# Altium project PM12_CFD.PrjPcb (part 2 of 2)

## Sheet ADCMP.SchDoc
size A4; SheetNumber: 4; SheetTotal: 5
Used 12 times, as channels CFD1, CFD2, CFD3, CFD4, CFD5, CFD6, CFD7, CFD8, CFD9, CFD10, CFD11, CFD12. Parts and nets are listed once, with the designators drawn on the sheet.
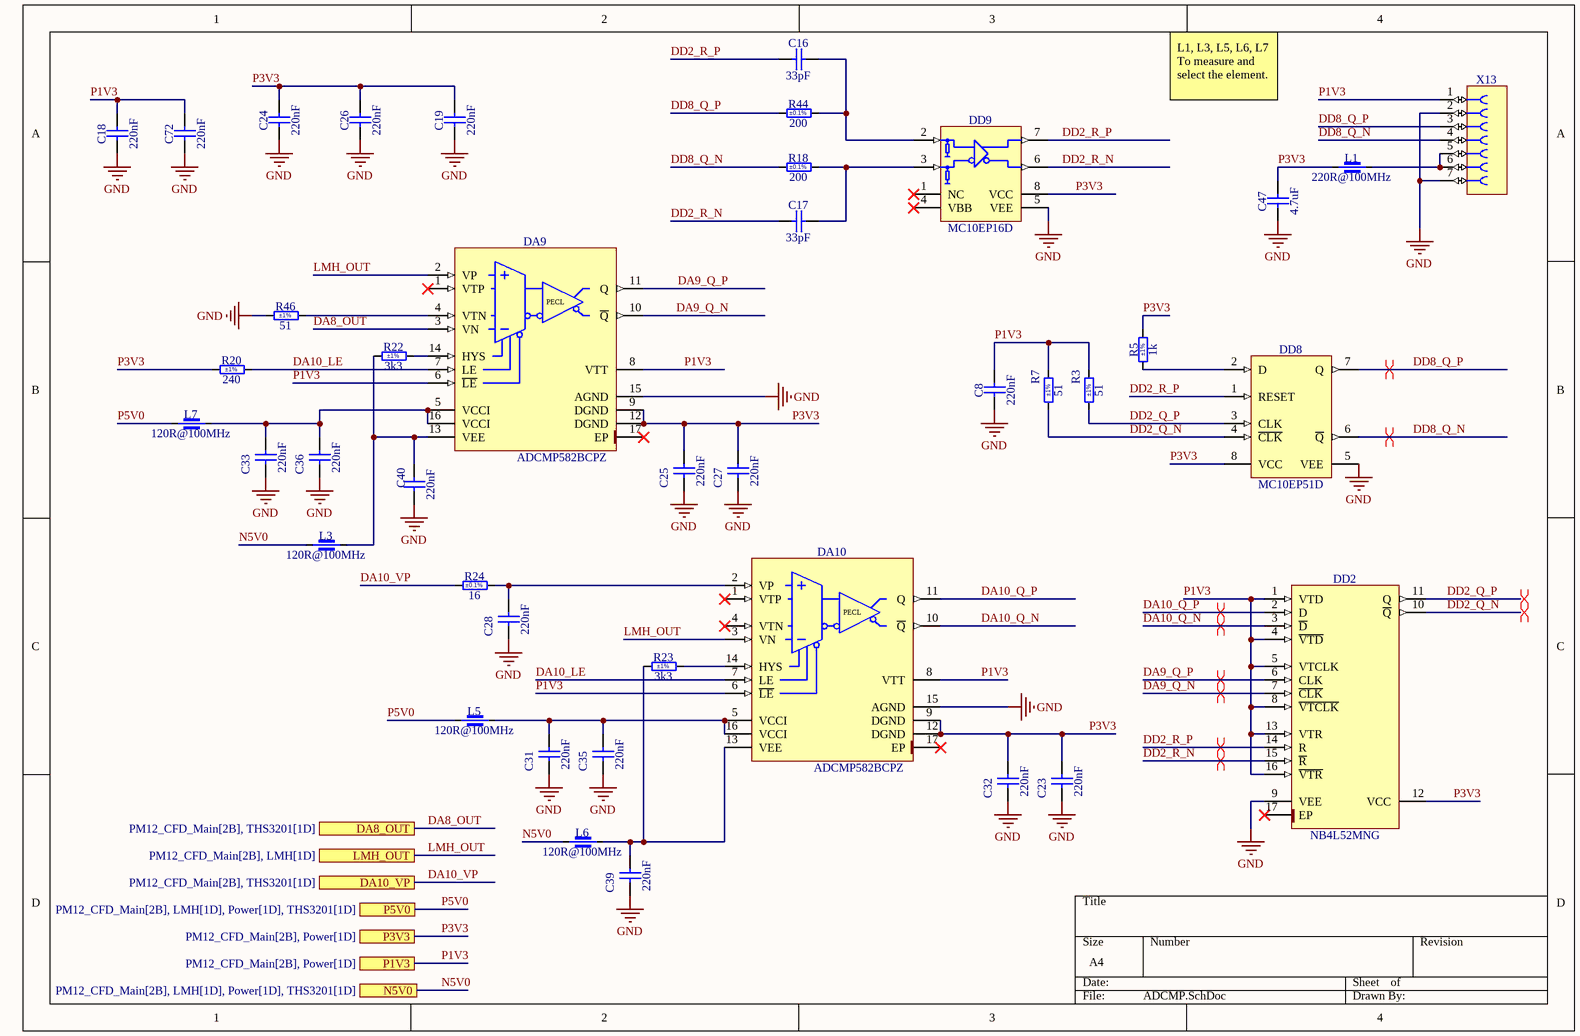
[diagram p4: ADCMP.SchDoc]

### Parts
C8  220nF  [CAPC2012X135N]
C16  33pF  [CAPC2012X135N]
C17  33pF  [CAPC2012X135N]
C18  220nF  [CAPC1608X87N]
C19  220nF  [CAPC2012X135N]
C23  220nF  [CAPC1608X87N]
C24  220nF  [CAPC2012X135N]
C25  220nF  [CAPC1608X87N]
C26  220nF  [CAPC2012X135N]
C27  220nF  [CAPC1608X87N]
C28  220nF  [CAPC1608X87N]
C31  220nF  [CAPC1608X87N]
C32  220nF  [CAPC1608X87N]
C33  220nF  [CAPC1608X87N]
C35  220nF  [CAPC1608X87N]
C36  220nF  [CAPC1608X87N]
C39  220nF  [CAPC1608X87N]
C40  220nF  [CAPC1608X87N]
C47  4.7uF  [CAPC3216X180N]
C72  220nF  [CAPC2012X135N]
DA9  ADCMP582BCPZ  [QFN50P300X300X80-17N-S145]
DA10  ADCMP582BCPZ  [QFN50P300X300X80-17N-S145]
DD2  NB4L52MNG  [QFN50P300X300X100-17N-S185]
DD8  MC10EP51D  [SOIC127P600X175-8N]
DD9  MC10EP16D  [SOIC127P600X175-8N]
L1  220R@100MHz  [INDC2012X105N]
L3  120R@100MHz  [INDC1608X95N]
L5  120R@100MHz  [INDC1608X95N]
L6  120R@100MHz  [INDC1608X95N]
L7  120R@100MHz  [INDC1608X95N]
R3  51  Tolerance: ±1%  [RESC2012X60N]
R5  1k  Tolerance: ±1%  [RESC2012X60N]
R7  51  Tolerance: ±1%  [RESC2012X60N]
R18  200  Tolerance: ±0.1%  [RESC2012X60N]
R20  240  Tolerance: ±1%  [RESC1608X55N]
R22  3k3  Tolerance: ±1%  [RESC1608X55N]
R23  3k3  Tolerance: ±1%  [RESC1608X55N]
R24  16  Tolerance: ±0.1%  [RESC1608X64N]
R44  200  Tolerance: ±0.1%  [RESC2012X60N]
R46  51  Tolerance: ±1%  [RESC1608X55N]
X13  Socket 7  [SAMTEC_CES-107-01-T-S]  (value not drawn)

### Ports
DA8_OUT (see PM12_CFD_Main[2B], THS3201[1D]), DA10_VP (see PM12_CFD_Main[2B], THS3201[1D]), LMH_OUT (see PM12_CFD_Main[2B], LMH[1D]), N5V0 (see PM12_CFD_Main[2B], LMH[1D], Power[1D], THS3201[1D]), P1V3 (see PM12_CFD_Main[2B], Power[1D]), P3V3 (see PM12_CFD_Main[2B], Power[1D]), P5V0 (see PM12_CFD_Main[2B], LMH[1D], Power[1D], THS3201[1D])

### Nets
GND: C8.1 C18.1 C19.1 C23.1 C24.1 C25.1 C26.1 C27.1 C28.1 C31.1 C32.1 C33.1 C35.1 C36.1 C39.1 C40.1 C47.1 C72.1 DA9.15(AGND) DA10.15(AGND) DD2.9(VEE) DD8.5(VEE) DD9.5(VEE) R46.1 X13.2 X13.7
DA8_OUT: DA9.3(VN) ; port DA8_OUT
DA9_Q_N: DA9.10(~{Q}) DD2.7(~{CLK})
DA9_Q_P: DA9.11(Q) DD2.6(CLK)
DA10_LE: DA9.7(LE) DA10.7(LE) R20.2
DA10_Q_N: DA10.10(~{Q}) DD2.3(~{D})
DA10_Q_P: DA10.11(Q) DD2.2(D)
DA10_VP: R24.1 ; port DA10_VP
DD2_Q_N: DD2.10(~{Q}) DD8.4(~{CLK}) R7.1
DD2_Q_P: DD2.11(Q) DD8.3(CLK) R3.1
DD2_R_N: C17.1 DD2.15(~{R}) DD9.6(~{Q})
DD2_R_P: C16.1 DD2.14(R) DD8.1(RESET) DD9.7(Q)
DD8_Q_N: DD8.6(~{Q}) R18.1 X13.4
DD8_Q_P: DD8.7(Q) R44.1 X13.3
LMH_OUT: DA9.2(VP) DA10.3(VN) ; port LMH_OUT
N5V0: L3.1 L6.1 ; port N5V0
P1V3: C8.2 C18.2 C72.2 DA9.6(~{LE}) DA9.8(VTT) DA10.6(~{LE}) DA10.8(VTT) DD2.1(VTD) DD2.4(~{VTD}) DD2.5(VTCLK) DD2.8(~{VTCLK}) DD2.13(VTR) DD2.16(~{VTR}) R3.2 R7.2 X13.1 ; port P1V3
P3V3: C19.2 C23.2 C24.2 C25.2 C26.2 C27.2 C32.2 C47.2 DA9.9(DGND) DA9.12(DGND) DA10.9(DGND) DA10.12(DGND) DD2.12(VCC) DD8.8(VCC) DD9.8(VCC) L1.1 R5.2 R20.1 ; port P3V3
P5V0: L5.1 L7.1 ; port P5V0
NetC16_2: C16.2 DD9.2(D0) R44.2
NetC17_2: C17.2 DD9.3(~{D0}) R18.2
NetC28_2: C28.2 DA10.2(VP) R24.2
NetC31_2: C31.2 C35.2 DA10.5(VCCI) DA10.16(VCCI) L5.2
NetC33_2: C33.2 C36.2 DA9.5(VCCI) DA9.16(VCCI) L7.2
NetC39_2: C39.2 DA10.13(VEE) L6.2 R23.1
NetC40_2: C40.2 DA9.13(VEE) L3.2 R22.1
NetDA9_4: DA9.4(VTN) R46.2
NetDA9_14: DA9.14(HYS) R22.2
NetDA10_14: DA10.14(HYS) R23.2
NetDD8_2: DD8.2(D) R5.1
NetL1_2: L1.2 X13.5 X13.6

Not connected (* = marked no-connect by the designer): DA9 1(VTP)* 17(EP)*; DA10 1(VTP)* 4(VTN)* 17(EP)*; DD2 17(EP)*; DD9 1(NC)* 4(VBB)*

### Channels
CFD1: designators end in _CFD1; ports DA8_OUT=DA8_OUT DA10_VP=DA10_VP LMH_OUT=LMH_OUT N5V0=N5V0 P1V3=P1V3 P3V3=P3V3 P5V0=P5V0
CFD2: designators end in _CFD2; ports DA8_OUT=DA8_OUT DA10_VP=DA10_VP LMH_OUT=LMH_OUT N5V0=N5V0 P1V3=P1V3 P3V3=P3V3 P5V0=P5V0
CFD3: designators end in _CFD3; ports DA8_OUT=DA8_OUT DA10_VP=DA10_VP LMH_OUT=LMH_OUT N5V0=N5V0 P1V3=P1V3 P3V3=P3V3 P5V0=P5V0
CFD4: designators end in _CFD4; ports DA8_OUT=DA8_OUT DA10_VP=DA10_VP LMH_OUT=LMH_OUT N5V0=N5V0 P1V3=P1V3 P3V3=P3V3 P5V0=P5V0
CFD5: designators end in _CFD5; ports DA8_OUT=DA8_OUT DA10_VP=DA10_VP LMH_OUT=LMH_OUT N5V0=N5V0 P1V3=P1V3 P3V3=P3V3 P5V0=P5V0
CFD6: designators end in _CFD6; ports DA8_OUT=DA8_OUT DA10_VP=DA10_VP LMH_OUT=LMH_OUT N5V0=N5V0 P1V3=P1V3 P3V3=P3V3 P5V0=P5V0
CFD7: designators end in _CFD7; ports DA8_OUT=DA8_OUT DA10_VP=DA10_VP LMH_OUT=LMH_OUT N5V0=N5V0 P1V3=P1V3 P3V3=P3V3 P5V0=P5V0
CFD8: designators end in _CFD8; ports DA8_OUT=DA8_OUT DA10_VP=DA10_VP LMH_OUT=LMH_OUT N5V0=N5V0 P1V3=P1V3 P3V3=P3V3 P5V0=P5V0
CFD9: designators end in _CFD9; ports DA8_OUT=DA8_OUT DA10_VP=DA10_VP LMH_OUT=LMH_OUT N5V0=N5V0 P1V3=P1V3 P3V3=P3V3 P5V0=P5V0
CFD10: designators end in _CFD10; ports DA8_OUT=DA8_OUT DA10_VP=DA10_VP LMH_OUT=LMH_OUT N5V0=N5V0 P1V3=P1V3 P3V3=P3V3 P5V0=P5V0
CFD11: designators end in _CFD11; ports DA8_OUT=DA8_OUT DA10_VP=DA10_VP LMH_OUT=LMH_OUT N5V0=N5V0 P1V3=P1V3 P3V3=P3V3 P5V0=P5V0
CFD12: designators end in _CFD12; ports DA8_OUT=DA8_OUT DA10_VP=DA10_VP LMH_OUT=LMH_OUT N5V0=N5V0 P1V3=P1V3 P3V3=P3V3 P5V0=P5V0

### Layout directives
differential pair: DA9_Q_N_CFD1, DA9_Q_P_CFD1, DA10_Q_N_CFD1, DA10_Q_P_CFD1, DD2_Q_N_CFD1, DD2_Q_P_CFD1, DD2_R_N_CFD1, DD2_R_P_CFD1, DD8_Q_N_CFD1, DD8_Q_P_CFD1

### Notes on the sheet
- L1, L3, L5, L6, L7 To measure and select the element.
- (in symbol ADCMP582BCPZ) PECL

### Library data of the parts
C8 C19 C24 C26 C72 = CC0805_220NF_50V_10%_X7R: Non-polarised capacitor; Part Description: SMD Multilayer Chip Ceramic Capacitor; Manufacturer: GENERIC; Manufacturer1 Part Number: GRM21BR71H224KA01L; Voltage: 50V; TC: X7R; Tolerance: ±10%; Part Number: CC0805_220NF_50V_10%_X7R; Component Kind: Standard; Component Type: Standard; Pin Count: 2; Value: 220nF; Status: Preferred; Manufacturer Part Number: CC0805_220NF_50V_10%_X7R; Case: 0805; Mounted: Yes; Socket: No; SMD: Yes; Sense: No; Manufacturer1 Example: MURATA; Manufacturer1 ComponentHeight: 1.35mm; HelpURL: \\cern.ch\dfs\Applications\Altium\Datasheets\CC0805_X7R_MURATA.pdf; Author: CERN DEM JLC; CreateDate: 03.12.2007; LatestRevisionDate: 03.12.2007
C16 C17 = CC0805_33PF_50V_5%_NP0: Non-polarised capacitor; Part Description: SMD Multilayer Chip Ceramic Capacitor; Manufacturer: GENERIC; Manufacturer1 Part Number: 223886115339; Voltage: 50V; TC: C0G/NP0; Tolerance: ±5%; Part Number: CC0805_33PF_50V_5%_NP0; Component Kind: Standard; Component Type: Standard; Pin Count: 2; Value: 33pF; Status: Preferred; Manufacturer Part Number: CC0805_33PF_50V_5%_NP0; Case: 0805; Mounted: Yes; Socket: No; SMD: Yes; Sense: No; Manufacturer1 Example: PHYCOMP; Manufacturer1 ComponentHeight: 1.35mm; HelpURL: \\cern.ch\dfs\Applications\Altium\Datasheets\CC0805_NP0_PHYCOMP.pdf; Author: CERN DEM JLC; CreateDate: 03.12.2007; LatestRevisionDate: 03.12.2007
C18 C23 C25 C27 C28 C31-C33 C35 C36 C39 C40 = CC0603_220NF_25V_10%_X7R: Non-polarised capacitor; Part Description: SMD Multilayer Chip Ceramic Capacitor; Manufacturer: GENERIC; Manufacturer1 Part Number: C0603C224K3RACTU; Voltage: 25V; TC: X7R; Tolerance: ±10%; Part Number: CC0603_220NF_25V_10%_X7R; Component Kind: Standard; Component Type: Standard; Pin Count: 2; Value: 220nF; Status: Preferred; Manufacturer Part Number: CC0603_220NF_25V_10%_X7R; Case: 0603; Mounted: Yes; Socket: No; SMD: Yes; Sense: No; Manufacturer1 Example: KEMET; Manufacturer1 ComponentHeight: 0.87mm; HelpURL: \\cern.ch\dfs\Applications\Altium\Datasheets\CC0603_X7R_KEMET.pdf; Author: CERN DEM JLC; CreateDate: 29.10.2014; LatestRevisionDate: 29.10.2014
C47 = CC1206_4.7UF_25V_10%_X7R: Non-polarised capacitor; Part Description: SMD Multilayer Chip Ceramic Capacitor; Manufacturer: GENERIC; Manufacturer1 Part Number: C1206C475K3RAC; Voltage: 25V; TC: X7R; Tolerance: ±10%; Part Number: CC1206_4.7UF_25V_10%_X7R; Component Kind: Standard; Component Type: Standard; Pin Count: 2; Value: 4.7uF; Status: Preferred; Manufacturer Part Number: CC1206_4.7UF_25V_10%_X7R; Case: 1206; Mounted: Yes; Socket: No; SMD: Yes; Sense: No; Manufacturer1 Example: KEMET; Manufacturer1 ComponentHeight: 1.8mm; HelpURL: \\cern.ch\dfs\Applications\Altium\Datasheets\CC1206_X7R_KEMET.pdf; Author: CERN DEM WB; CreateDate: 25.07.2018; LatestRevisionDate: 25.07.2018
DA9 DA10 = ADCMP582BCPZ: Ultrafast SiGe Voltage Comparator; Manufacturer: ANALOG DEVICES; PressFit: No; Bonding: No; Part Number: ADCMP582BCPZ; Component Kind: Standard; Component Type: Standard; Device: ADCMP582BCPZ; PackageDescription: QFN, 0.50mm Pitch, Square; 16 Pin, 3.00mm L X 3.00mm W X 0.80mm H body (w/Thermal Tab 1.45 X 1.45mm), IPC Medium Density; Part Description: Ultrafast SiGe Voltage Comparator; Manufacturer Part Number: ADCMP582BCP; Pin Count: 17; Case: QFN16; Mounted: Yes; Socket: No; SMD: Yes; Sense: No; ComponentHeight: 0.8mm; Author: CERN DEM MR; HelpURL: \\cern.ch\dfs\Applications\Altium\Datasheets\ADCMP582BCPZ.pdf; CreateDate: 23.01.2018; LatestRevisionDate: 31.03.2022
DD2 = NB4L52MNG: 2.5 V/3.3 V/5.0 V Differential Data/Clock D Flip-Flop with Reset; Manufacturer: ON SEMICONDUCTOR; PressFit: No; Bonding: No; Part Number: NB4L52MNG; Component Kind: Standard; Component Type: Standard; Device: NB4L52MNG; PackageDescription: QFN, 0.50mm Pitch, Square; 16 Pin, 3.00mm L X 3.00mm W X 1.00mm H body (w/Thermal Tab 1.85 X 1.85mm), IPC Medium Density; Part Description: 2.5 V/3.3 V/5.0 V Differential Data/Clock D Flip-Flop with Reset; Manufacturer Part Number: NB4L52MN; Pin Count: 16; Case: QFN16; Mounted: Yes; Socket: No; SMD: Yes; Sense: No; ComponentHeight: 1mm; Author: CERN DEM MR; HelpURL: \\cern.ch\dfs\Applications\Altium\Datasheets\NB4L52MNG.pdf; CreateDate: 15.01.2016; LatestRevisionDate: 04.04.2022
DD8 = MC10EP51D: 3.3V/5V ECL D Flip-Flop with Reset and Differential Clock; Manufacturer: ON SEMICONDUCTOR; PressFit: No; Bonding: No; Part Number: MC10EP51D; Component Kind: Standard; Component Type: Standard; Device: MC10EP51D; PackageDescription: SOIC 8, Pitch 1.27mm - Body 4x5mm, IPC Medium Density; Part Description: 3.3V/5V ECL D Flip-Flop with Reset and Differential Clock; Manufacturer Part Number: MC10EP51D; Pin Count: 8; Case: SOIC8; Mounted: Yes; Socket: No; SMD: Yes; Sense: No; ComponentHeight: 1.75mm; Author: CERN DEM HF; HelpURL: \\cern.ch\dfs\Applications\Altium\Datasheets\MC10EP51.pdf; CreateDate: 25.04.2024; LatestRevisionDate: 25.04.2024
DD9 = MC10EP16D: 3.3V / 5V ECL Differential Receiver/Driver; Manufacturer: ON SEMICONDUCTOR; PressFit: No; Bonding: No; Part Number: MC10EP16D; Component Kind: Standard; Component Type: Standard; Device: MC10EP16D; PackageDescription: SOIC 8, Pitch 1.27mm - Body 4x5mm, IPC Medium Density; Part Description: 3.3V/5V ECL Differential Receiver/Driver; Manufacturer Part Number: MC10EP16D; Pin Count: 8; Case: SOIC8; Mounted: Yes; Socket: No; SMD: Yes; Sense: No; ComponentHeight: 1.75mm; Author: CERN DEM HF; HelpURL: \\cern.ch\dfs\Applications\Altium\Datasheets\MC10EP16.pdf; CreateDate: 25.04.2024; LatestRevisionDate: 25.04.2024
L1 = IND0805_TDK_MPZ2012S221A: Part Description: SMT Chip Bead for General Power Line (MPZ Series); Manufacturer: TDK; Power: 3A; Resistance: 0.04R; Tolerance: ±25%; Part Number: IND0805_TDK_MPZ2012S221A; Component Kind: Standard; Component Type: Standard; Pin Count: 2; Value: 220R@100MHz; Manufacturer Part Number: MPZ2012S221A; Case: 0805; Mounted: Yes; Socket: No; SMD: Yes; Sense: No; ComponentHeight: 1.05mm; HelpURL: \\cern.ch\dfs\Applications\Altium\Datasheets\IND0805_TDK_MPZ2012.pdf; Author: CERN DEM HF; CreateDate: 04.10.2021; LatestRevisionDate: 04.10.2021
L3 L5-L7 = IND0603_MURATA_BLM18PG121SN1D: Part Description: SMD EMIFIL Chip Ferrite Bead; Manufacturer: MURATA; Power: 2A; Resistance: 0.05R; Part Number: IND0603_MURATA_BLM18PG121SN1D; Component Kind: Standard; Component Type: Standard; Pin Count: 2; Value: 120R@100MHz; Manufacturer Part Number: BLM18PG121SN1D; Case: 0603; Mounted: Yes; Socket: No; SMD: Yes; Sense: No; ComponentHeight: 0.95mm; HelpURL: \\cern.ch\dfs\Applications\Altium\Datasheets\IND0603_MURATA_BLM18P.pdf; Author: CERN DEM BC; CreateDate: 27.07.2015; LatestRevisionDate: 25.10.2018
R3 R7 = R0805_51R_1%_0.125W_100PPM: Resistor - 1%; Part Description: General Purpose Thick Film Chip Resistor; Manufacturer: GENERIC; Manufacturer1 Part Number: NRC10F51R0TRF; Power: 0.125W; TC: ±100ppm/°C; PressFit: No; Part Number: R0805_51R_1%_0.125W_100PPM; Component Kind: Standard; Component Type: Standard; Pin Count: 2; Value: 51; Status: Preferred; Manufacturer Part Number: R0805_51R_1%_0.125W_100PPM; Case: 0805; Mounted: Yes; Sense: No; Socket: No; SMD: Yes; Manufacturer1 Example: NIC COMPONENT; Manufacturer1 ComponentHeight: 0.6mm; HelpURL: \\cern.ch\dfs\Applications\Altium\Datasheets\R0805_NIC_NRC.pdf; Author: CERN DEM JLC; CreateDate: 03.12.2007; LatestRevisionDate: 13.03.2008
R5 = R0805_1K_1%_0.125W_100PPM: Resistor - 1%; Part Description: General Purpose Thick Film Chip Resistor; Manufacturer: GENERIC; Manufacturer1 Part Number: NRC10F1001TRF; Power: 0.125W; TC: ±100ppm/°C; PressFit: No; Part Number: R0805_1K_1%_0.125W_100PPM; Component Kind: Standard; Component Type: Standard; Pin Count: 2; Value: 1k; Status: Preferred; Manufacturer Part Number: R0805_1K_1%_0.125W_100PPM; Case: 0805; Mounted: Yes; Sense: No; Socket: No; SMD: Yes; Manufacturer1 Example: NIC COMPONENT; Manufacturer1 ComponentHeight: 0.6mm; HelpURL: \\cern.ch\dfs\Applications\Altium\Datasheets\R0805_NIC_NRC.pdf; Author: CERN DEM JLC; CreateDate: 03.12.2007; LatestRevisionDate: 13.03.2008
R18 R44 = R0805_200R_0.1%_0.1W_10PPM: Resistor - 0.1%; Part Description: Thin Film Chip Resistor; Manufacturer: GENERIC; Manufacturer1 Part Number: RN73C2A200RBTG; Power: 0.1W; TC: ±10ppm; PressFit: No; Part Number: R0805_200R_0.1%_0.1W_10PPM; Component Kind: Standard; Component Type: Standard; Pin Count: 2; Value: 200; Status: Not Recommended; Manufacturer Part Number: R0805_200R_0.1%_0.1W_10PPM; Case: 0805; Mounted: Yes; Sense: No; Socket: No; SMD: Yes; Manufacturer1 Example: TYCO HOLSWORTHY; Manufacturer1 ComponentHeight: 0.6mm; HelpURL: \\cern.ch\dfs\Applications\Altium\Datasheets\R0805_Tyco_RN73.pdf; Author: CERN DEM JLC; CreateDate: 03.12.2007; LatestRevisionDate: 13.03.2008
R20 = R0603_240R_1%_0.1W_100PPM: Resistor - 1%; Part Description: General Purpose Thick Film Chip Resistor; Manufacturer: GENERIC; Manufacturer1 Part Number: NRC06F2400TRF; Power: 0.1W; TC: ±100ppm/°C; PressFit: No; Part Number: R0603_240R_1%_0.1W_100PPM; Component Kind: Standard; Component Type: Standard; Pin Count: 2; Value: 240; Status: Preferred; Manufacturer Part Number: R0603_240R_1%_0.1W_100PPM; Case: 0603; Mounted: Yes; Sense: No; Socket: No; SMD: Yes; Manufacturer1 Example: NIC COMPONENT; Manufacturer1 ComponentHeight: 0.55mm; HelpURL: \\cern.ch\dfs\Applications\Altium\Datasheets\R0603_NIC_NRC.pdf; Author: CERN DEM JLC; CreateDate: 03.12.2007; LatestRevisionDate: 13.03.2008
R22 R23 = R0603_3K3_1%_0.1W_100PPM: Resistor - 1%; Part Description: General Purpose Thick Film Chip Resistor; Manufacturer: GENERIC; Manufacturer1 Part Number: NRC06F3301TRF; Power: 0.1W; TC: ±100ppm/°C; PressFit: No; Part Number: R0603_3K3_1%_0.1W_100PPM; Component Kind: Standard; Component Type: Standard; Pin Count: 2; Value: 3k3; Status: Preferred; Manufacturer Part Number: R0603_3K3_1%_0.1W_100PPM; Case: 0603; Mounted: Yes; Sense: No; Socket: No; SMD: Yes; Manufacturer1 Example: NIC COMPONENT; Manufacturer1 ComponentHeight: 0.55mm; HelpURL: \\cern.ch\dfs\Applications\Altium\Datasheets\R0603_NIC_NRC.pdf; Author: CERN DEM JLC; CreateDate: 03.12.2007; LatestRevisionDate: 13.03.2008
R24 = R0603_16R_0.1%_0.1W_10PPM: Resistor - 0.1%; Part Description: Thin Film Chip Resistor; Manufacturer: GENERIC; Manufacturer1 Part Number: RT0603BRB0716RL; Power: 0.1W; TC: ±10ppm/°C; PressFit: No; Part Number: R0603_16R_0.1%_0.1W_10PPM; Component Kind: Standard; Component Type: Standard; Pin Count: 2; Value: 16; Status: Not Recommended; Manufacturer Part Number: R0603_16R_0.1%_0.1W_10PPM; Case: 0603; Mounted: Yes; Sense: No; Socket: No; SMD: Yes; Manufacturer1 Example: YAGEO; Manufacturer1 ComponentHeight: 0.55mm; HelpURL: \\cern.ch\dfs\Applications\Altium\Datasheets\R0603_YAGEO_RT.pdf; Author: CERN DEM HF; CreateDate: 25.04.2024; LatestRevisionDate: 25.04.2024
R46 = R0603_51R_1%_0.1W_100PPM: Resistor - 1%; Part Description: General Purpose Thick Film Chip Resistor; Manufacturer: GENERIC; Manufacturer1 Part Number: NRC06F51R0TRF; Power: 0.1W; TC: ±100ppm/°C; PressFit: No; Part Number: R0603_51R_1%_0.1W_100PPM; Component Kind: Standard; Component Type: Standard; Pin Count: 2; Value: 51; Status: Preferred; Manufacturer Part Number: R0603_51R_1%_0.1W_100PPM; Case: 0603; Mounted: Yes; Sense: No; Socket: No; SMD: Yes; Manufacturer1 Example: NIC COMPONENT; Manufacturer1 ComponentHeight: 0.55mm; HelpURL: \\cern.ch\dfs\Applications\Altium\Datasheets\R0603_NIC_NRC.pdf; Author: CERN DEM JLC; CreateDate: 03.12.2007; LatestRevisionDate: 13.03.2008
X13 = SAMTEC_CES-107-01-L-S: Connector 7 Female; Part Description: 7 Contacts, Pitch 2.54mm, Single Row Through Mount Straight Socket (Lead Length 3.25mm); Manufacturer: SAMTEC; PressFit: No; Author: CERN DEM HF; Part Number: SAMTEC_CES-107-01-L-S; Component Kind: Standard; Component Type: Standard; Pin Count: 7; Family: Socket 7; Mounted: Yes; Socket: No; SMD: No; Sense: No; Status: None; Manufacturer Part Number: CES-107-01-L-S; ComponentHeight: 5.08mm; HelpURL: \\cern.ch\dfs\Applications\Altium\Datasheets\SAMTEC_CES-107-01-T-S.pdf; CreateDate: 25.04.2024; LatestRevisionDate: 25.04.2024

## Nets that join several sheets
GND: PM12_CFD_Main (8 pins), CFD1 (21 pins), CFD2 (21 pins), CFD3 (21 pins), CFD4 (21 pins), CFD5 (21 pins), CFD6 (21 pins), CFD7 (21 pins), CFD8 (21 pins), CFD9 (21 pins), CFD10 (21 pins), CFD11 (21 pins), CFD12 (21 pins), CFD1 (8 pins), CFD2 (8 pins), CFD3 (8 pins), CFD4 (8 pins), CFD5 (8 pins), CFD6 (8 pins), CFD7 (8 pins), CFD8 (8 pins), CFD9 (8 pins), CFD10 (8 pins), CFD11 (8 pins), CFD12 (8 pins), CFD1 (13 pins), CFD2 (13 pins), CFD3 (13 pins), CFD4 (13 pins), CFD5 (13 pins), CFD6 (13 pins), CFD7 (13 pins), CFD8 (13 pins), CFD9 (13 pins), CFD10 (13 pins), CFD11 (13 pins), CFD12 (13 pins), CFD1 (26 pins), CFD2 (26 pins), CFD3 (26 pins), CFD4 (26 pins), CFD5 (26 pins), CFD6 (26 pins), CFD7 (26 pins), CFD8 (26 pins), CFD9 (26 pins), CFD10 (26 pins), CFD11 (26 pins), CFD12 (26 pins)
N5V5: PM12_CFD_Main (C21.2 C45.2 C46.2 L4.2), CFD1 (L9_CFD1.1), CFD2 (L9_CFD2.1), CFD3 (L9_CFD3.1), CFD4 (L9_CFD4.1), CFD5 (L9_CFD5.1), CFD6 (L9_CFD6.1), CFD7 (L9_CFD7.1), CFD8 (L9_CFD8.1), CFD9 (L9_CFD9.1), CFD10 (L9_CFD10.1), CFD11 (L9_CFD11.1), CFD12 (L9_CFD12.1)
P5V5: PM12_CFD_Main (C20.1 C34.1 C44.1 L2.2), CFD1 (L8_CFD1.1), CFD2 (L8_CFD2.1), CFD3 (L8_CFD3.1), CFD4 (L8_CFD4.1), CFD5 (L8_CFD5.1), CFD6 (L8_CFD6.1), CFD7 (L8_CFD7.1), CFD8 (L8_CFD8.1), CFD9 (L8_CFD9.1), CFD10 (L8_CFD10.1), CFD11 (L8_CFD11.1), CFD12 (L8_CFD12.1)
DA2_P: CFD1 (R2_CFD1.1 X12_CFD1.1), CFD1 (R50_CFD1.1)
DA2_P: CFD2 (R2_CFD2.1 X12_CFD2.1), CFD2 (R50_CFD2.1)
DA2_P: CFD3 (R2_CFD3.1 X12_CFD3.1), CFD3 (R50_CFD3.1)
DA2_P: CFD4 (R2_CFD4.1 X12_CFD4.1), CFD4 (R50_CFD4.1)
DA2_P: CFD5 (R2_CFD5.1 X12_CFD5.1), CFD5 (R50_CFD5.1)
DA2_P: CFD6 (R2_CFD6.1 X12_CFD6.1), CFD6 (R50_CFD6.1)
DA2_P: CFD7 (R2_CFD7.1 X12_CFD7.1), CFD7 (R50_CFD7.1)
DA2_P: CFD8 (R2_CFD8.1 X12_CFD8.1), CFD8 (R50_CFD8.1)
DA2_P: CFD9 (R2_CFD9.1 X12_CFD9.1), CFD9 (R50_CFD9.1)
DA2_P: CFD10 (R2_CFD10.1 X12_CFD10.1), CFD10 (R50_CFD10.1)
DA2_P: CFD11 (R2_CFD11.1 X12_CFD11.1), CFD11 (R50_CFD11.1)
DA2_P: CFD12 (R2_CFD12.1 X12_CFD12.1), CFD12 (R50_CFD12.1)
DA6_P: CFD1 (C12_CFD1.2 DA6_CFD1.3 DA20_CFD1.3), CFD1 (X5_CFD1.2)
DA6_P: CFD2 (C12_CFD2.2 DA6_CFD2.3 DA20_CFD2.3), CFD2 (X5_CFD2.2)
DA6_P: CFD3 (C12_CFD3.2 DA6_CFD3.3 DA20_CFD3.3), CFD3 (X5_CFD3.2)
DA6_P: CFD4 (C12_CFD4.2 DA6_CFD4.3 DA20_CFD4.3), CFD4 (X5_CFD4.2)
DA6_P: CFD5 (C12_CFD5.2 DA6_CFD5.3 DA20_CFD5.3), CFD5 (X5_CFD5.2)
DA6_P: CFD6 (C12_CFD6.2 DA6_CFD6.3 DA20_CFD6.3), CFD6 (X5_CFD6.2)
DA6_P: CFD7 (C12_CFD7.2 DA6_CFD7.3 DA20_CFD7.3), CFD7 (X5_CFD7.2)
DA6_P: CFD8 (C12_CFD8.2 DA6_CFD8.3 DA20_CFD8.3), CFD8 (X5_CFD8.2)
DA6_P: CFD9 (C12_CFD9.2 DA6_CFD9.3 DA20_CFD9.3), CFD9 (X5_CFD9.2)
DA6_P: CFD10 (C12_CFD10.2 DA6_CFD10.3 DA20_CFD10.3), CFD10 (X5_CFD10.2)
DA6_P: CFD11 (C12_CFD11.2 DA6_CFD11.3 DA20_CFD11.3), CFD11 (X5_CFD11.2)
DA6_P: CFD12 (C12_CFD12.2 DA6_CFD12.3 DA20_CFD12.3), CFD12 (X5_CFD12.2)
DA8_OUT: CFD1 (DA8_CFD1.6 R19_CFD1.2), CFD1 (DA9_CFD1.3)
DA8_OUT: CFD2 (DA8_CFD2.6 R19_CFD2.2), CFD2 (DA9_CFD2.3)
DA8_OUT: CFD3 (DA8_CFD3.6 R19_CFD3.2), CFD3 (DA9_CFD3.3)
DA8_OUT: CFD4 (DA8_CFD4.6 R19_CFD4.2), CFD4 (DA9_CFD4.3)
DA8_OUT: CFD5 (DA8_CFD5.6 R19_CFD5.2), CFD5 (DA9_CFD5.3)
DA8_OUT: CFD6 (DA8_CFD6.6 R19_CFD6.2), CFD6 (DA9_CFD6.3)
DA8_OUT: CFD7 (DA8_CFD7.6 R19_CFD7.2), CFD7 (DA9_CFD7.3)
DA8_OUT: CFD8 (DA8_CFD8.6 R19_CFD8.2), CFD8 (DA9_CFD8.3)
DA8_OUT: CFD9 (DA8_CFD9.6 R19_CFD9.2), CFD9 (DA9_CFD9.3)
DA8_OUT: CFD10 (DA8_CFD10.6 R19_CFD10.2), CFD10 (DA9_CFD10.3)
DA8_OUT: CFD11 (DA8_CFD11.6 R19_CFD11.2), CFD11 (DA9_CFD11.3)
DA8_OUT: CFD12 (DA8_CFD12.6 R19_CFD12.2), CFD12 (DA9_CFD12.3)
DA10_VP: CFD1 (X5_CFD1.4), CFD1 (R24_CFD1.1)
DA10_VP: CFD2 (X5_CFD2.4), CFD2 (R24_CFD2.1)
DA10_VP: CFD3 (X5_CFD3.4), CFD3 (R24_CFD3.1)
DA10_VP: CFD4 (X5_CFD4.4), CFD4 (R24_CFD4.1)
DA10_VP: CFD5 (X5_CFD5.4), CFD5 (R24_CFD5.1)
DA10_VP: CFD6 (X5_CFD6.4), CFD6 (R24_CFD6.1)
DA10_VP: CFD7 (X5_CFD7.4), CFD7 (R24_CFD7.1)
DA10_VP: CFD8 (X5_CFD8.4), CFD8 (R24_CFD8.1)
DA10_VP: CFD9 (X5_CFD9.4), CFD9 (R24_CFD9.1)
DA10_VP: CFD10 (X5_CFD10.4), CFD10 (R24_CFD10.1)
DA10_VP: CFD11 (X5_CFD11.4), CFD11 (R24_CFD11.1)
DA10_VP: CFD12 (X5_CFD12.4), CFD12 (R24_CFD12.1)
LMH_OUT: CFD1 (DA7_CFD1.7 R39_CFD1.1 X4_CFD1.1), CFD1 (DA9_CFD1.2 DA10_CFD1.3)
LMH_OUT: CFD2 (DA7_CFD2.7 R39_CFD2.1 X4_CFD2.1), CFD2 (DA9_CFD2.2 DA10_CFD2.3)
LMH_OUT: CFD3 (DA7_CFD3.7 R39_CFD3.1 X4_CFD3.1), CFD3 (DA9_CFD3.2 DA10_CFD3.3)
LMH_OUT: CFD4 (DA7_CFD4.7 R39_CFD4.1 X4_CFD4.1), CFD4 (DA9_CFD4.2 DA10_CFD4.3)
LMH_OUT: CFD5 (DA7_CFD5.7 R39_CFD5.1 X4_CFD5.1), CFD5 (DA9_CFD5.2 DA10_CFD5.3)
LMH_OUT: CFD6 (DA7_CFD6.7 R39_CFD6.1 X4_CFD6.1), CFD6 (DA9_CFD6.2 DA10_CFD6.3)
LMH_OUT: CFD7 (DA7_CFD7.7 R39_CFD7.1 X4_CFD7.1), CFD7 (DA9_CFD7.2 DA10_CFD7.3)
LMH_OUT: CFD8 (DA7_CFD8.7 R39_CFD8.1 X4_CFD8.1), CFD8 (DA9_CFD8.2 DA10_CFD8.3)
LMH_OUT: CFD9 (DA7_CFD9.7 R39_CFD9.1 X4_CFD9.1), CFD9 (DA9_CFD9.2 DA10_CFD9.3)
LMH_OUT: CFD10 (DA7_CFD10.7 R39_CFD10.1 X4_CFD10.1), CFD10 (DA9_CFD10.2 DA10_CFD10.3)
LMH_OUT: CFD11 (DA7_CFD11.7 R39_CFD11.1 X4_CFD11.1), CFD11 (DA9_CFD11.2 DA10_CFD11.3)
LMH_OUT: CFD12 (DA7_CFD12.7 R39_CFD12.1 X4_CFD12.1), CFD12 (DA9_CFD12.2 DA10_CFD12.3)
N3V0: CFD1 (C9_CFD1.2 DA1_CFD1.5), CFD1 (C11_CFD1.2 DA7_CFD1.5 DA7_CFD1.9)
N3V0: CFD2 (C9_CFD2.2 DA1_CFD2.5), CFD2 (C11_CFD2.2 DA7_CFD2.5 DA7_CFD2.9)
N3V0: CFD3 (C9_CFD3.2 DA1_CFD3.5), CFD3 (C11_CFD3.2 DA7_CFD3.5 DA7_CFD3.9)
N3V0: CFD4 (C9_CFD4.2 DA1_CFD4.5), CFD4 (C11_CFD4.2 DA7_CFD4.5 DA7_CFD4.9)
N3V0: CFD5 (C9_CFD5.2 DA1_CFD5.5), CFD5 (C11_CFD5.2 DA7_CFD5.5 DA7_CFD5.9)
N3V0: CFD6 (C9_CFD6.2 DA1_CFD6.5), CFD6 (C11_CFD6.2 DA7_CFD6.5 DA7_CFD6.9)
N3V0: CFD7 (C9_CFD7.2 DA1_CFD7.5), CFD7 (C11_CFD7.2 DA7_CFD7.5 DA7_CFD7.9)
N3V0: CFD8 (C9_CFD8.2 DA1_CFD8.5), CFD8 (C11_CFD8.2 DA7_CFD8.5 DA7_CFD8.9)
N3V0: CFD9 (C9_CFD9.2 DA1_CFD9.5), CFD9 (C11_CFD9.2 DA7_CFD9.5 DA7_CFD9.9)
N3V0: CFD10 (C9_CFD10.2 DA1_CFD10.5), CFD10 (C11_CFD10.2 DA7_CFD10.5 DA7_CFD10.9)
N3V0: CFD11 (C9_CFD11.2 DA1_CFD11.5), CFD11 (C11_CFD11.2 DA7_CFD11.5 DA7_CFD11.9)
N3V0: CFD12 (C9_CFD12.2 DA1_CFD12.5), CFD12 (C11_CFD12.2 DA7_CFD12.5 DA7_CFD12.9)
N5V0: CFD1 (C146_CFD1.2 DA12_CFD1.1 R1_CFD1.1), CFD1 (DA6_CFD1.4 DA20_CFD1.4), CFD1 (7 pins), CFD1 (L3_CFD1.1 L6_CFD1.1)
N5V0: CFD2 (C146_CFD2.2 DA12_CFD2.1 R1_CFD2.1), CFD2 (DA6_CFD2.4 DA20_CFD2.4), CFD2 (7 pins), CFD2 (L3_CFD2.1 L6_CFD2.1)
N5V0: CFD3 (C146_CFD3.2 DA12_CFD3.1 R1_CFD3.1), CFD3 (DA6_CFD3.4 DA20_CFD3.4), CFD3 (7 pins), CFD3 (L3_CFD3.1 L6_CFD3.1)
N5V0: CFD4 (C146_CFD4.2 DA12_CFD4.1 R1_CFD4.1), CFD4 (DA6_CFD4.4 DA20_CFD4.4), CFD4 (7 pins), CFD4 (L3_CFD4.1 L6_CFD4.1)
N5V0: CFD5 (C146_CFD5.2 DA12_CFD5.1 R1_CFD5.1), CFD5 (DA6_CFD5.4 DA20_CFD5.4), CFD5 (7 pins), CFD5 (L3_CFD5.1 L6_CFD5.1)
N5V0: CFD6 (C146_CFD6.2 DA12_CFD6.1 R1_CFD6.1), CFD6 (DA6_CFD6.4 DA20_CFD6.4), CFD6 (7 pins), CFD6 (L3_CFD6.1 L6_CFD6.1)
N5V0: CFD7 (C146_CFD7.2 DA12_CFD7.1 R1_CFD7.1), CFD7 (DA6_CFD7.4 DA20_CFD7.4), CFD7 (7 pins), CFD7 (L3_CFD7.1 L6_CFD7.1)
N5V0: CFD8 (C146_CFD8.2 DA12_CFD8.1 R1_CFD8.1), CFD8 (DA6_CFD8.4 DA20_CFD8.4), CFD8 (7 pins), CFD8 (L3_CFD8.1 L6_CFD8.1)
N5V0: CFD9 (C146_CFD9.2 DA12_CFD9.1 R1_CFD9.1), CFD9 (DA6_CFD9.4 DA20_CFD9.4), CFD9 (7 pins), CFD9 (L3_CFD9.1 L6_CFD9.1)
N5V0: CFD10 (C146_CFD10.2 DA12_CFD10.1 R1_CFD10.1), CFD10 (DA6_CFD10.4 DA20_CFD10.4), CFD10 (7 pins), CFD10 (L3_CFD10.1 L6_CFD10.1)
N5V0: CFD11 (C146_CFD11.2 DA12_CFD11.1 R1_CFD11.1), CFD11 (DA6_CFD11.4 DA20_CFD11.4), CFD11 (7 pins), CFD11 (L3_CFD11.1 L6_CFD11.1)
N5V0: CFD12 (C146_CFD12.2 DA12_CFD12.1 R1_CFD12.1), CFD12 (DA6_CFD12.4 DA20_CFD12.4), CFD12 (7 pins), CFD12 (L3_CFD12.1 L6_CFD12.1)
P1V3: CFD1 (C42_CFD1.1 DA13_CFD1.5 R28_CFD1.2), CFD1 (16 pins)
P1V3: CFD2 (C42_CFD2.1 DA13_CFD2.5 R28_CFD2.2), CFD2 (16 pins)
P1V3: CFD3 (C42_CFD3.1 DA13_CFD3.5 R28_CFD3.2), CFD3 (16 pins)
P1V3: CFD4 (C42_CFD4.1 DA13_CFD4.5 R28_CFD4.2), CFD4 (16 pins)
P1V3: CFD5 (C42_CFD5.1 DA13_CFD5.5 R28_CFD5.2), CFD5 (16 pins)
P1V3: CFD6 (C42_CFD6.1 DA13_CFD6.5 R28_CFD6.2), CFD6 (16 pins)
P1V3: CFD7 (C42_CFD7.1 DA13_CFD7.5 R28_CFD7.2), CFD7 (16 pins)
P1V3: CFD8 (C42_CFD8.1 DA13_CFD8.5 R28_CFD8.2), CFD8 (16 pins)
P1V3: CFD9 (C42_CFD9.1 DA13_CFD9.5 R28_CFD9.2), CFD9 (16 pins)
P1V3: CFD10 (C42_CFD10.1 DA13_CFD10.5 R28_CFD10.2), CFD10 (16 pins)
P1V3: CFD11 (C42_CFD11.1 DA13_CFD11.5 R28_CFD11.2), CFD11 (16 pins)
P1V3: CFD12 (C42_CFD12.1 DA13_CFD12.5 R28_CFD12.2), CFD12 (16 pins)
P2V5: CFD1 (C7_CFD1.2 DA3_CFD1.5), CFD1 (C3_CFD1.2 DA7_CFD1.6 DA7_CFD1.8)
P2V5: CFD2 (C7_CFD2.2 DA3_CFD2.5), CFD2 (C3_CFD2.2 DA7_CFD2.6 DA7_CFD2.8)
P2V5: CFD3 (C7_CFD3.2 DA3_CFD3.5), CFD3 (C3_CFD3.2 DA7_CFD3.6 DA7_CFD3.8)
P2V5: CFD4 (C7_CFD4.2 DA3_CFD4.5), CFD4 (C3_CFD4.2 DA7_CFD4.6 DA7_CFD4.8)
P2V5: CFD5 (C7_CFD5.2 DA3_CFD5.5), CFD5 (C3_CFD5.2 DA7_CFD5.6 DA7_CFD5.8)
P2V5: CFD6 (C7_CFD6.2 DA3_CFD6.5), CFD6 (C3_CFD6.2 DA7_CFD6.6 DA7_CFD6.8)
P2V5: CFD7 (C7_CFD7.2 DA3_CFD7.5), CFD7 (C3_CFD7.2 DA7_CFD7.6 DA7_CFD7.8)
P2V5: CFD8 (C7_CFD8.2 DA3_CFD8.5), CFD8 (C3_CFD8.2 DA7_CFD8.6 DA7_CFD8.8)
P2V5: CFD9 (C7_CFD9.2 DA3_CFD9.5), CFD9 (C3_CFD9.2 DA7_CFD9.6 DA7_CFD9.8)
P2V5: CFD10 (C7_CFD10.2 DA3_CFD10.5), CFD10 (C3_CFD10.2 DA7_CFD10.6 DA7_CFD10.8)
P2V5: CFD11 (C7_CFD11.2 DA3_CFD11.5), CFD11 (C3_CFD11.2 DA7_CFD11.6 DA7_CFD11.8)
P2V5: CFD12 (C7_CFD12.2 DA3_CFD12.5), CFD12 (C3_CFD12.2 DA7_CFD12.6 DA7_CFD12.8)
P3V3: CFD1 (C22_CFD1.1 C29_CFD1.2 DA13_CFD1.4 R29_CFD1.1), CFD1 (18 pins)
P3V3: CFD2 (C22_CFD2.1 C29_CFD2.2 DA13_CFD2.4 R29_CFD2.1), CFD2 (18 pins)
P3V3: CFD3 (C22_CFD3.1 C29_CFD3.2 DA13_CFD3.4 R29_CFD3.1), CFD3 (18 pins)
P3V3: CFD4 (C22_CFD4.1 C29_CFD4.2 DA13_CFD4.4 R29_CFD4.1), CFD4 (18 pins)
P3V3: CFD5 (C22_CFD5.1 C29_CFD5.2 DA13_CFD5.4 R29_CFD5.1), CFD5 (18 pins)
P3V3: CFD6 (C22_CFD6.1 C29_CFD6.2 DA13_CFD6.4 R29_CFD6.1), CFD6 (18 pins)
P3V3: CFD7 (C22_CFD7.1 C29_CFD7.2 DA13_CFD7.4 R29_CFD7.1), CFD7 (18 pins)
P3V3: CFD8 (C22_CFD8.1 C29_CFD8.2 DA13_CFD8.4 R29_CFD8.1), CFD8 (18 pins)
P3V3: CFD9 (C22_CFD9.1 C29_CFD9.2 DA13_CFD9.4 R29_CFD9.1), CFD9 (18 pins)
P3V3: CFD10 (C22_CFD10.1 C29_CFD10.2 DA13_CFD10.4 R29_CFD10.1), CFD10 (18 pins)
P3V3: CFD11 (C22_CFD11.1 C29_CFD11.2 DA13_CFD11.4 R29_CFD11.1), CFD11 (18 pins)
P3V3: CFD12 (C22_CFD12.1 C29_CFD12.2 DA13_CFD12.4 R29_CFD12.1), CFD12 (18 pins)
P5V0: CFD1 (C135_CFD1.1 DA11_CFD1.3 R25_CFD1.1), CFD1 (DA6_CFD1.7 DA20_CFD1.7), CFD1 (7 pins), CFD1 (L5_CFD1.1 L7_CFD1.1)
P5V0: CFD2 (C135_CFD2.1 DA11_CFD2.3 R25_CFD2.1), CFD2 (DA6_CFD2.7 DA20_CFD2.7), CFD2 (7 pins), CFD2 (L5_CFD2.1 L7_CFD2.1)
P5V0: CFD3 (C135_CFD3.1 DA11_CFD3.3 R25_CFD3.1), CFD3 (DA6_CFD3.7 DA20_CFD3.7), CFD3 (7 pins), CFD3 (L5_CFD3.1 L7_CFD3.1)
P5V0: CFD4 (C135_CFD4.1 DA11_CFD4.3 R25_CFD4.1), CFD4 (DA6_CFD4.7 DA20_CFD4.7), CFD4 (7 pins), CFD4 (L5_CFD4.1 L7_CFD4.1)
P5V0: CFD5 (C135_CFD5.1 DA11_CFD5.3 R25_CFD5.1), CFD5 (DA6_CFD5.7 DA20_CFD5.7), CFD5 (7 pins), CFD5 (L5_CFD5.1 L7_CFD5.1)
P5V0: CFD6 (C135_CFD6.1 DA11_CFD6.3 R25_CFD6.1), CFD6 (DA6_CFD6.7 DA20_CFD6.7), CFD6 (7 pins), CFD6 (L5_CFD6.1 L7_CFD6.1)
P5V0: CFD7 (C135_CFD7.1 DA11_CFD7.3 R25_CFD7.1), CFD7 (DA6_CFD7.7 DA20_CFD7.7), CFD7 (7 pins), CFD7 (L5_CFD7.1 L7_CFD7.1)
P5V0: CFD8 (C135_CFD8.1 DA11_CFD8.3 R25_CFD8.1), CFD8 (DA6_CFD8.7 DA20_CFD8.7), CFD8 (7 pins), CFD8 (L5_CFD8.1 L7_CFD8.1)
P5V0: CFD9 (C135_CFD9.1 DA11_CFD9.3 R25_CFD9.1), CFD9 (DA6_CFD9.7 DA20_CFD9.7), CFD9 (7 pins), CFD9 (L5_CFD9.1 L7_CFD9.1)
P5V0: CFD10 (C135_CFD10.1 DA11_CFD10.3 R25_CFD10.1), CFD10 (DA6_CFD10.7 DA20_CFD10.7), CFD10 (7 pins), CFD10 (L5_CFD10.1 L7_CFD10.1)
P5V0: CFD11 (C135_CFD11.1 DA11_CFD11.3 R25_CFD11.1), CFD11 (DA6_CFD11.7 DA20_CFD11.7), CFD11 (7 pins), CFD11 (L5_CFD11.1 L7_CFD11.1)
P5V0: CFD12 (C135_CFD12.1 DA11_CFD12.3 R25_CFD12.1), CFD12 (DA6_CFD12.7 DA20_CFD12.7), CFD12 (7 pins), CFD12 (L5_CFD12.1 L7_CFD12.1)